# Altium schematic sheet AMP_N2.schDoc
size A; SheetNumber: 2; SheetTotal: 6
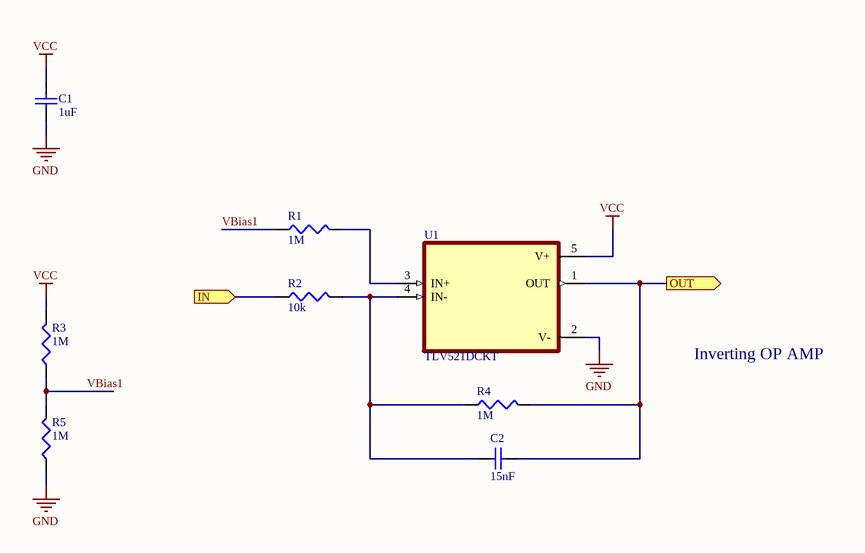
[diagram p0: AMP_N2.schDoc]

## Parts
C1  1uF  [SMD-0603]
C2  15nF  [SMD-0603]
R1  1M  [SMD-0603]
R2  10k  [SMD-0603]
R3  1M  [SMD-0603]
R4  1M  [SMD-0603]
R5  1M  [SMD-0603]
U1  TLV521DCKT  [TLV521-SOT-5N]

## Ports
IN (in), OUT (out)

## Nets
GND: C1.1 R5.1 U1.2(V-)
VCC: C1.2 R3.2 U1.5(V+)
IN: R2.1 ; port IN
OUT: C2.2 R4.2 U1.1(OUT) ; port OUT
VBias1: R1.1 R3.1 R5.2
NetC2_1: C2.1 R2.2 R4.1 U1.4(IN-)
NetR1_2: R1.2 U1.3(IN+)

## Notes on the sheet
- Inverting OP AMP

## Library data of the parts
C1 C2 = CAP0603: Ceramic Capacitor 0603
R1-R5 = RES0603: Resistor-0603
U1 = TLV521DCKT: 350-nA Nanopower, Single, RRIO, CMOS Input, Operational Amplifier for Cost-Sensitive Systems 5-SC70 -40 to 125; MF: Texas Instruments; DigiKey-Purchase-URL: https://snapeda.com/shop?store=DigiKey&id=809196; Package: SOT-SC70-5 Texas Instruments; Mouser-Purchase-URL: https://snapeda.com/shop?store=Mouser&id=809196; Value: *; Arrow_Electronics-Purchase-URL: https://snapeda.com/shop?store=Arrow+Electronics&id=809196; Texas_Instruments-Purchase-URL: https://snapeda.com/shop?store=Texas+Instruments&id=809196; SnapEDA_Link: https://www.snapeda.com/parts/TLV521DCKT/Texas%20Instruments/view-part/809196/?ref=snap; Availability: Unavailable; Price: None; MP: TLV521DCKT